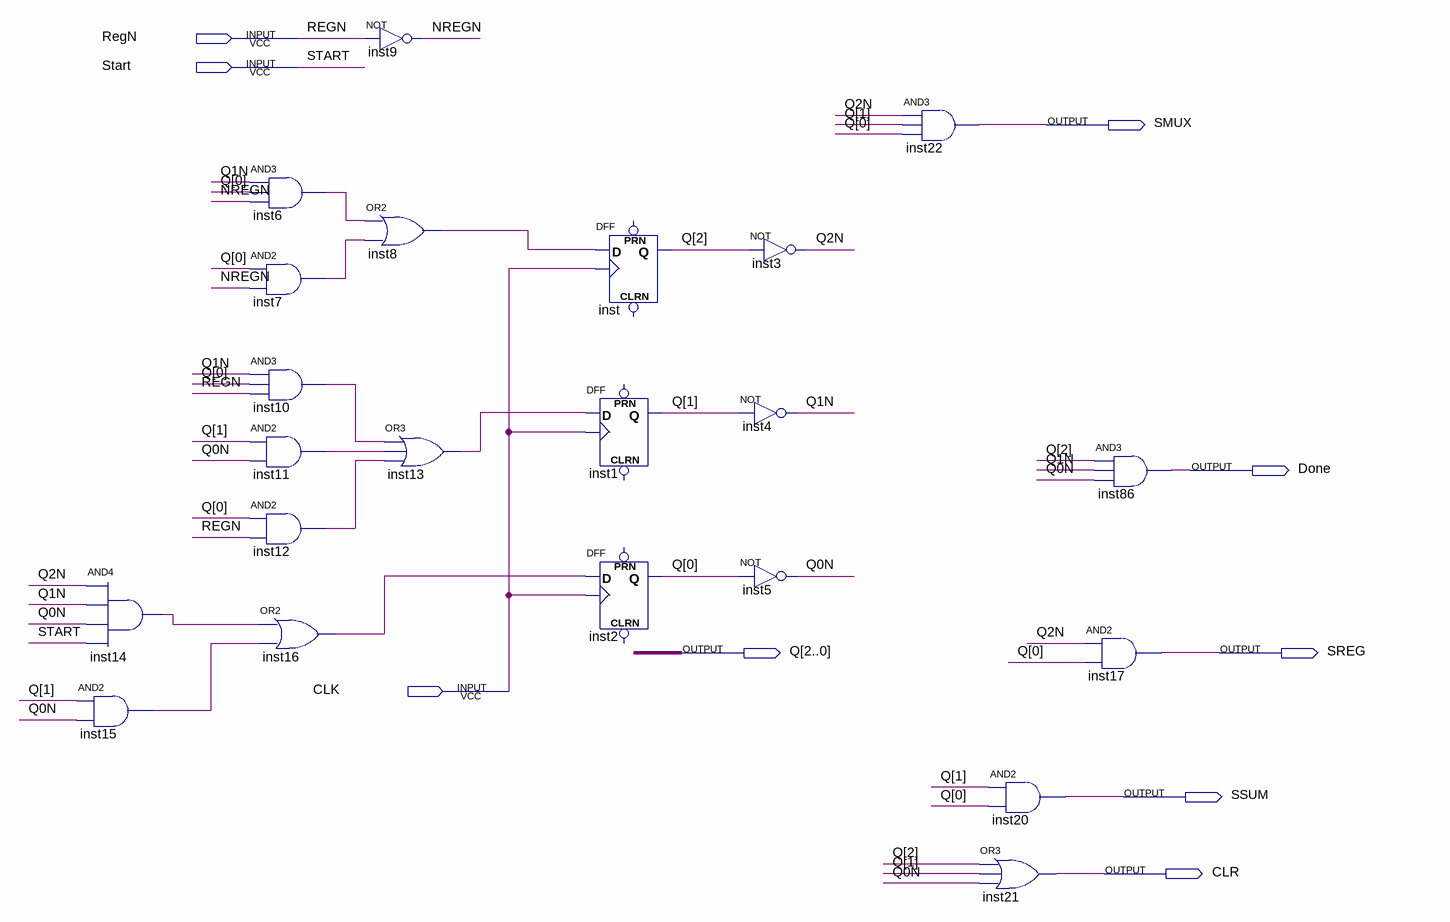
[diagram p0: schematic sheet]
// Quartus schematic Controller.bdf as structural Verilog: 22 symbols, 9 pins
module Controller (
  input  RegN,
  input  Start,
  input  CLK,
  output SMUX,
  output Done,
  output [2:0] Q,
  output SREG,
  output SSUM,
  output CLR
);

  wire inst6_out, inst7_out, inst8_out, inst10_out, inst11_out, inst12_out, inst13_out, inst14_out,
       inst15_out, inst16_out, NREGN, Q0N, Q1N, Q2N;

  and inst14 (inst14_out, Q2N, Q1N, Q0N, Start);
  and inst15 (inst15_out, Q[1], Q0N);
  and inst6 (inst6_out, Q1N, Q[0], NREGN);
  and inst7 (inst7_out, Q[0], NREGN);
  and inst10 (inst10_out, Q1N, Q[0], RegN);
  and inst11 (inst11_out, Q[1], Q0N);
  and inst12 (inst12_out, Q[0], RegN);
  or inst16 (inst16_out, inst14_out, inst15_out);
  not inst9 (NREGN, RegN);
  or inst8 (inst8_out, inst6_out, inst7_out);
  or inst13 (inst13_out, inst10_out, inst11_out, inst12_out);
  DFF inst (.CLK(CLK), .D(inst8_out), .Q(Q[2]));  // open: CLRN, PRN
  DFF inst1 (.CLK(CLK), .D(inst13_out), .Q(Q[1]));  // open: CLRN, PRN
  DFF inst2 (.CLK(CLK), .D(inst16_out), .Q(Q[0]));  // open: CLRN, PRN
  not inst3 (Q2N, Q[2]);
  not inst4 (Q1N, Q[1]);
  not inst5 (Q0N, Q[0]);
  and inst22 (SMUX, Q2N, Q[1], Q[0]);
  and inst20 (SSUM, Q[1], Q[0]);
  or inst21 (CLR, Q[2], Q[1], Q0N);
  and inst86 (Done, Q[2], Q1N, Q0N);
  and inst17 (SREG, Q2N, Q[0]);
endmodule
